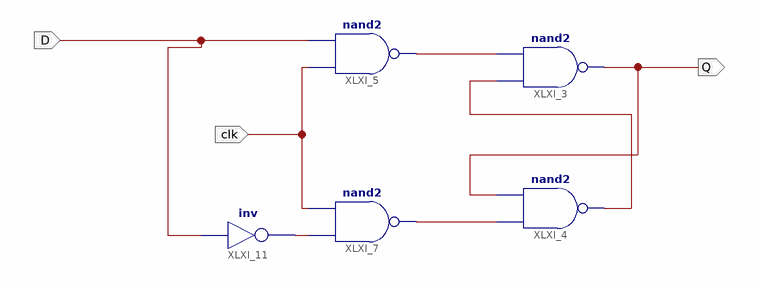
[diagram p0: schematic sheet 1]
// Xilinx ISE schematic F_F.sch (spartan3a) as structural Verilog: 5 symbols, 3 ports
module F_F (
  input  clk,
  input  D,
  output Q
);

  wire R, XLXN_1, XLXN_4, XLXN_20;

  nand XLXI_3 (Q, XLXN_20, XLXN_1);
  nand XLXI_4 (XLXN_20, XLXN_4, Q);
  nand XLXI_5 (XLXN_1, clk, D);
  nand XLXI_7 (XLXN_4, R, clk);
  not XLXI_11 (R, D);
endmodule
